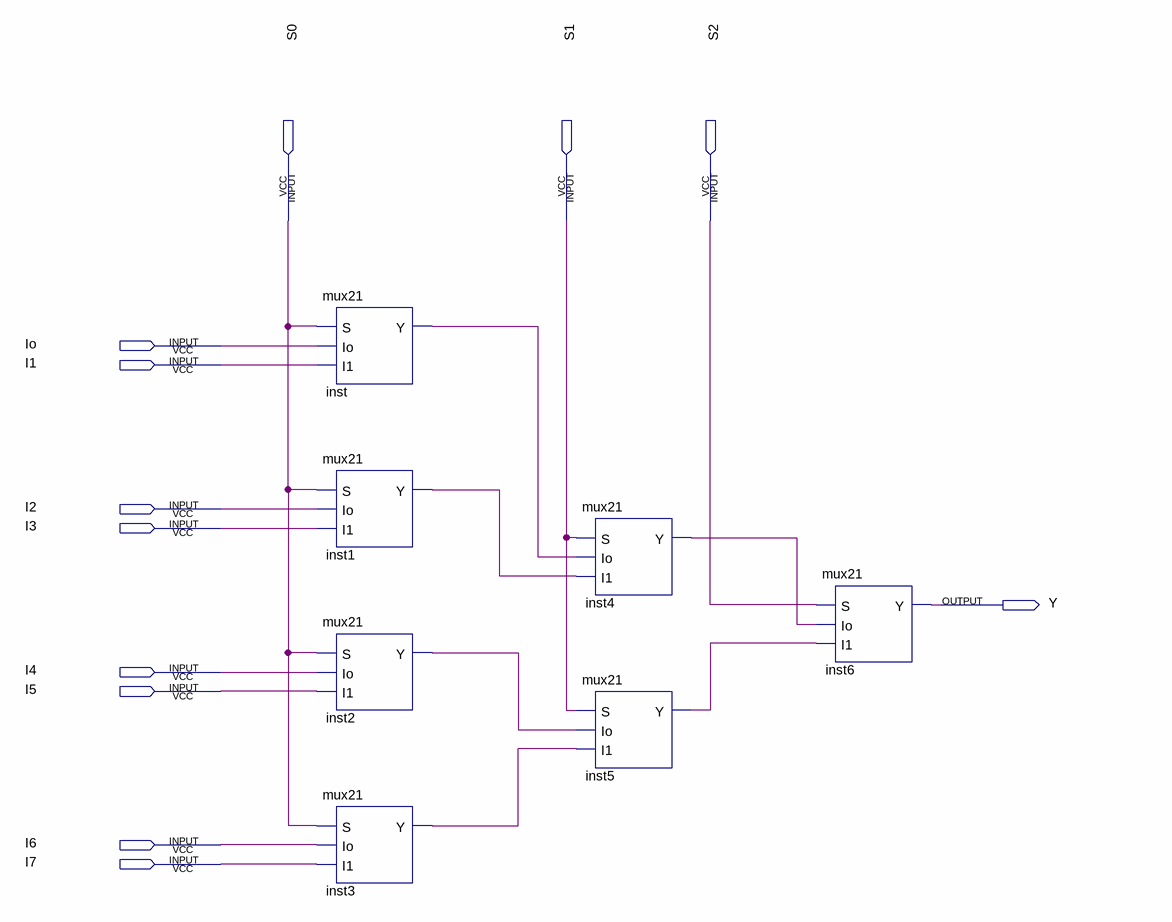
[diagram p0: schematic sheet]
// Quartus schematic mux81.bdf as structural Verilog: 7 symbols, 12 pins
module mux81 (
  input  S0,
  input  S1,
  input  S2,
  input  Io,
  input  I1,
  input  I2,
  input  I3,
  input  I4,
  input  I5,
  input  I6,
  input  I7,
  output Y
);

  wire inst1_y, inst2_y, inst3_y, inst4_y, inst5_y, inst_y;

  mux21 inst (.S(S0), .Io(Io), .I1(I1), .Y(inst_y));
  mux21 inst1 (.S(S0), .Io(I2), .I1(I3), .Y(inst1_y));
  mux21 inst2 (.S(S0), .Io(I4), .I1(I5), .Y(inst2_y));
  mux21 inst3 (.S(S0), .Io(I6), .I1(I7), .Y(inst3_y));
  mux21 inst4 (.S(S1), .Io(inst_y), .I1(inst1_y), .Y(inst4_y));
  mux21 inst5 (.S(S1), .Io(inst2_y), .I1(inst3_y), .Y(inst5_y));
  mux21 inst6 (.S(S2), .Io(inst4_y), .I1(inst5_y), .Y(Y));
endmodule
